# EAGLE design VCA3+ (EAGLE 7.2.0)
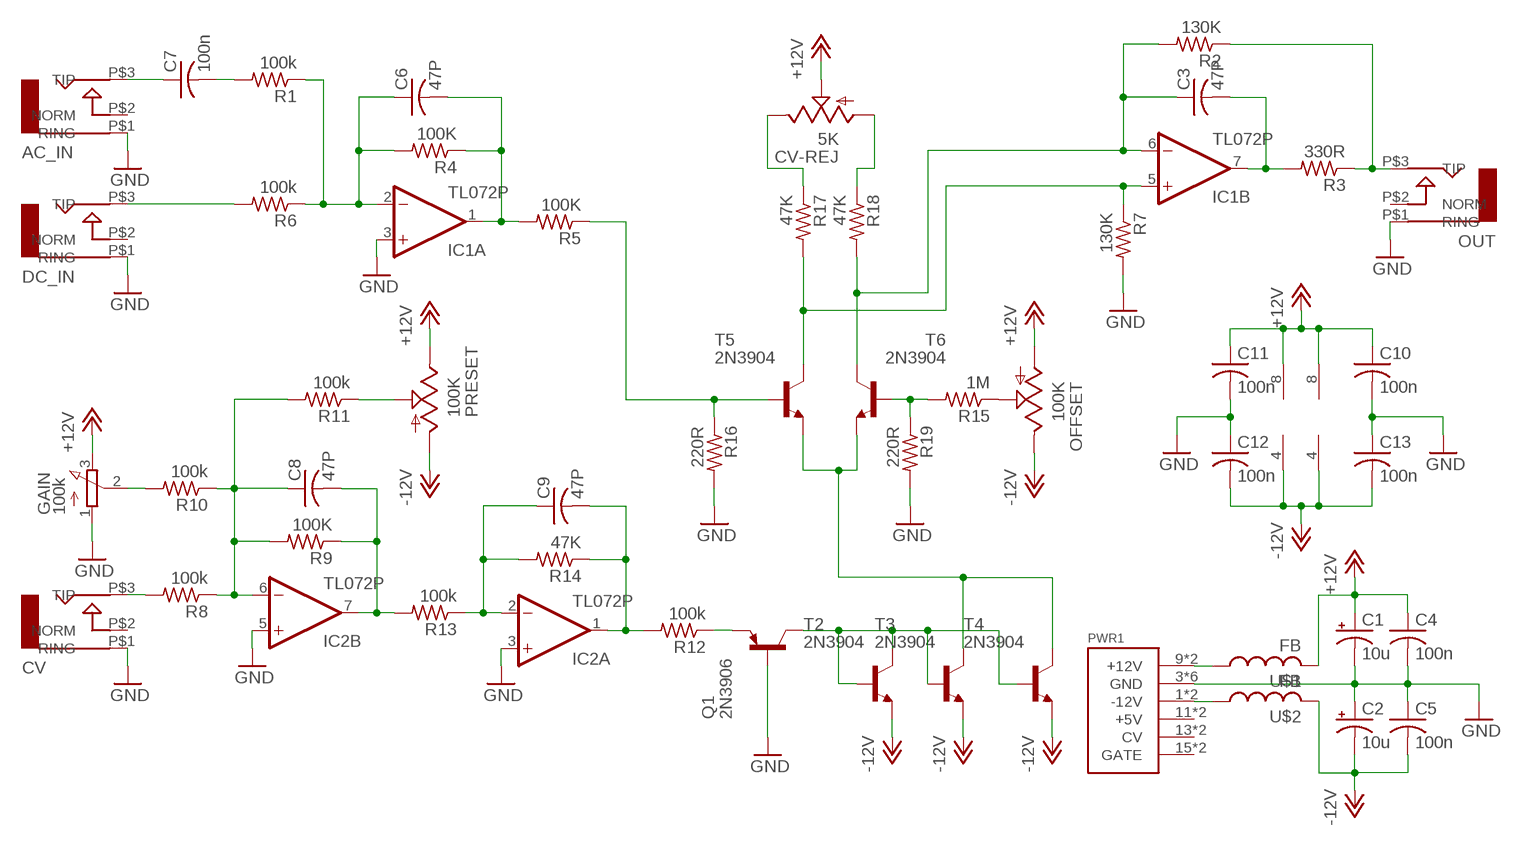
[diagram p0: schematic, sheet 1]

## Parts
AC_IN  AUDIO-JACK  [ERTHENVAR-JACK-90DEG]
C1  10u  CPOL-USB45181A  [B45181A]
C2  10u  CPOL-USB45181A  [B45181A]
C3  47P  C-US050-024X044  [C050-024X044]
C4  100n  C-US050-024X044  [C050-024X044]
C5  100n  C-US050-024X044  [C050-024X044]
C6  47P  C-US050-024X044  [C050-024X044]
C7  100n  C-US050-024X044  [C050-024X044]
C8  47P  C-US050-024X044  [C050-024X044]
C9  47P  C-US050-024X044  [C050-024X044]
C10  100n  C-US050-024X044  [C050-024X044]
C11  100n  C-US050-024X044  [C050-024X044]
C12  100n  C-US050-024X044  [C050-024X044]
C13  100n  C-US050-024X044  [C050-024X044]
CV  AUDIO-JACK  [ERTHENVAR-JACK-90DEG]
CV-REJ  5K  TRIM_US-B64Y  [B64Y]
DC_IN  AUDIO-JACK  [ERTHENVAR-JACK-90DEG]
GAIN  100k  3RP/1610N  [3RP/1610N]
IC1  TL072P  [DIL08]
IC2  TL072P  [DIL08]
OFFSET  100K  TRIM_US-B64Y  [B64Y]
OUT  AUDIO-JACK  [ERTHENVAR-JACK-90DEG]
PRESET  100K  TRIM_US-B64Y  [B64Y]
PWR1  POWER  [POWER_16]
Q1  2N3906  [TO92]
R1  100k  R-US_0207/10  [0207/10]
R2  130K  R-US_0207/10  [0207/10]
R3  330R  R-US_0207/10  [0207/10]
R4  100K  R-US_0207/10  [0207/10]
R5  100K  R-US_0207/10  [0207/10]
R6  100k  R-US_0207/10  [0207/10]
R7  130K  R-US_0207/10  [0207/10]
R8  100k  R-US_0207/10  [0207/10]
R9  100K  R-US_0207/10  [0207/10]
R10  100k  R-US_0207/10  [0207/10]
R11  100k  R-US_0207/10  [0207/10]
R12  100k  R-US_0207/10  [0207/10]
R13  100k  R-US_0207/10  [0207/10]
R14  47K  R-US_0207/10  [0207/10]
R15  1M  R-US_0207/10  [0207/10]
R16  220R  R-US_0207/10  [0207/10]
R17  47K  R-US_0207/10  [0207/10]
R18  47K  R-US_0207/10  [0207/10]
R19  220R  R-US_0207/10  [0207/10]
T2  2N3904  [TO92]
T3  2N3904  [TO92]
T4  2N3904  [TO92]
T5  2N3904  [TO92]
T6  2N3904  [TO92]
U$1  FB  [FB]
U$2  FB  [FB]

## Nets
+12V: C1.+ C4.1 C10.1 C11.1 CV-REJ.S GAIN.3(E) IC1.8(P:V+) IC2.8(P:V+) OFFSET.A PRESET.E U$1.P$2
-12V: C2.- C5.2 C12.2 C13.2 IC1.4(P:V-) IC2.4(P:V-) OFFSET.E PRESET.A T2.3(E) T3.3(E) T4.3(E) U$2.P$2
GND: AC_IN.P$1(RING) C1.- C2.+ C4.2 C5.1 C10.2 C11.2 C12.1 C13.1 CV.P$1(RING) DC_IN.P$1(RING) GAIN.1(A) IC1.3(A:+IN) IC2.3(A:+IN) IC2.5(B:+IN) OUT.P$1(RING) PWR1.3(GND) PWR1.4(GND) PWR1.5(GND) PWR1.6(GND) PWR1.7(GND) PWR1.8(GND) Q1.2(B) R7.2 R16.2 R19.2
N$1: PWR1.9(+12V) PWR1.10(+12V) U$1.P$1
N$2: PWR1.1(-12V) PWR1.2(-12V) U$2.P$1
N$3: AC_IN.P$3(TIP) C7.1
N$4: C7.2 R1.2
N$5: C3.2 IC1.7(B:OUT) R3.2
N$6: OUT.P$3(TIP) R2.1 R3.1
N$7: C6.1 IC1.2(A:-IN) R1.1 R4.2 R6.1
N$8: C6.2 IC1.1(A:OUT) R4.1 R5.2
N$9: IC1.5(B:+IN) R7.1 R17.2 T5.1(C)
N$10: CV.P$3(TIP) R8.2
N$11: C8.1 IC2.6(B:-IN) R8.1 R9.2 R10.1 R11.2
N$12: GAIN.2(S) R10.2
N$13: PRESET.S R11.1
N$14: DC_IN.P$3(TIP) R6.2
N$15: C8.2 IC2.7(B:OUT) R9.1 R13.2
N$16: Q1.3(E) R12.1
N$17: C9.1 IC2.2(A:-IN) R13.1 R14.2
N$18: C9.2 IC2.1(A:OUT) R12.2 R14.1
N$19: Q1.1(C) T2.1(C) T2.2(B) T3.2(B) T4.2(B)
N$20: T3.1(C) T4.1(C) T5.3(E) T6.3(E)
N$21: OFFSET.S R15.1
N$22: R5.1 R16.1 T5.2(B)
N$24: R15.2 R19.1 T6.2(B)
N$25: C3.1 IC1.6(B:-IN) R2.2 R18.2 T6.1(C)
N$26: CV-REJ.E R17.1
N$27: CV-REJ.A R18.1
Unconnected: AC_IN.P$2(NORM) CV.P$2(NORM) DC_IN.P$2(NORM) OUT.P$2(NORM) PWR1.11(+5V) PWR1.12(+5V) PWR1.13(CV) PWR1.14(CV) PWR1.15(GATE) PWR1.16(GATE)

## Library data of the parts
AC_IN CV DC_IN OUT = erthenvar:AUDIO-JACK: Switching Mono 3.5mm Audio Jack from Erthenvar.
C1 C2 = rcl:CPOL-US: POLARIZED CAPACITOR, American symbol
C3-C13 = rcl:C-US: CAPACITOR, American symbol
CV-REJ OFFSET PRESET = pot:TRIM_US-: POTENTIOMETER
GAIN = pot:3RP/1610N: 16mm Potentiometer one level Source: http://www.alphapotentiometers.net/html/16mm_pot_2.html
IC1 IC2 = linear:TL072: OP AMP
PWR1 = eurorack:POWER
Q1 = transistor-pnp:2N3906: PNP Transistor
R1-R19 = rcl:R-US_: RESISTOR, American symbol
T2-T6 = transistor:2N3904: NPN TRANSISTOR
U$1 U$2 = adafruit:FB: Ferrite bead Digikey #P9821BK-ND

## Board
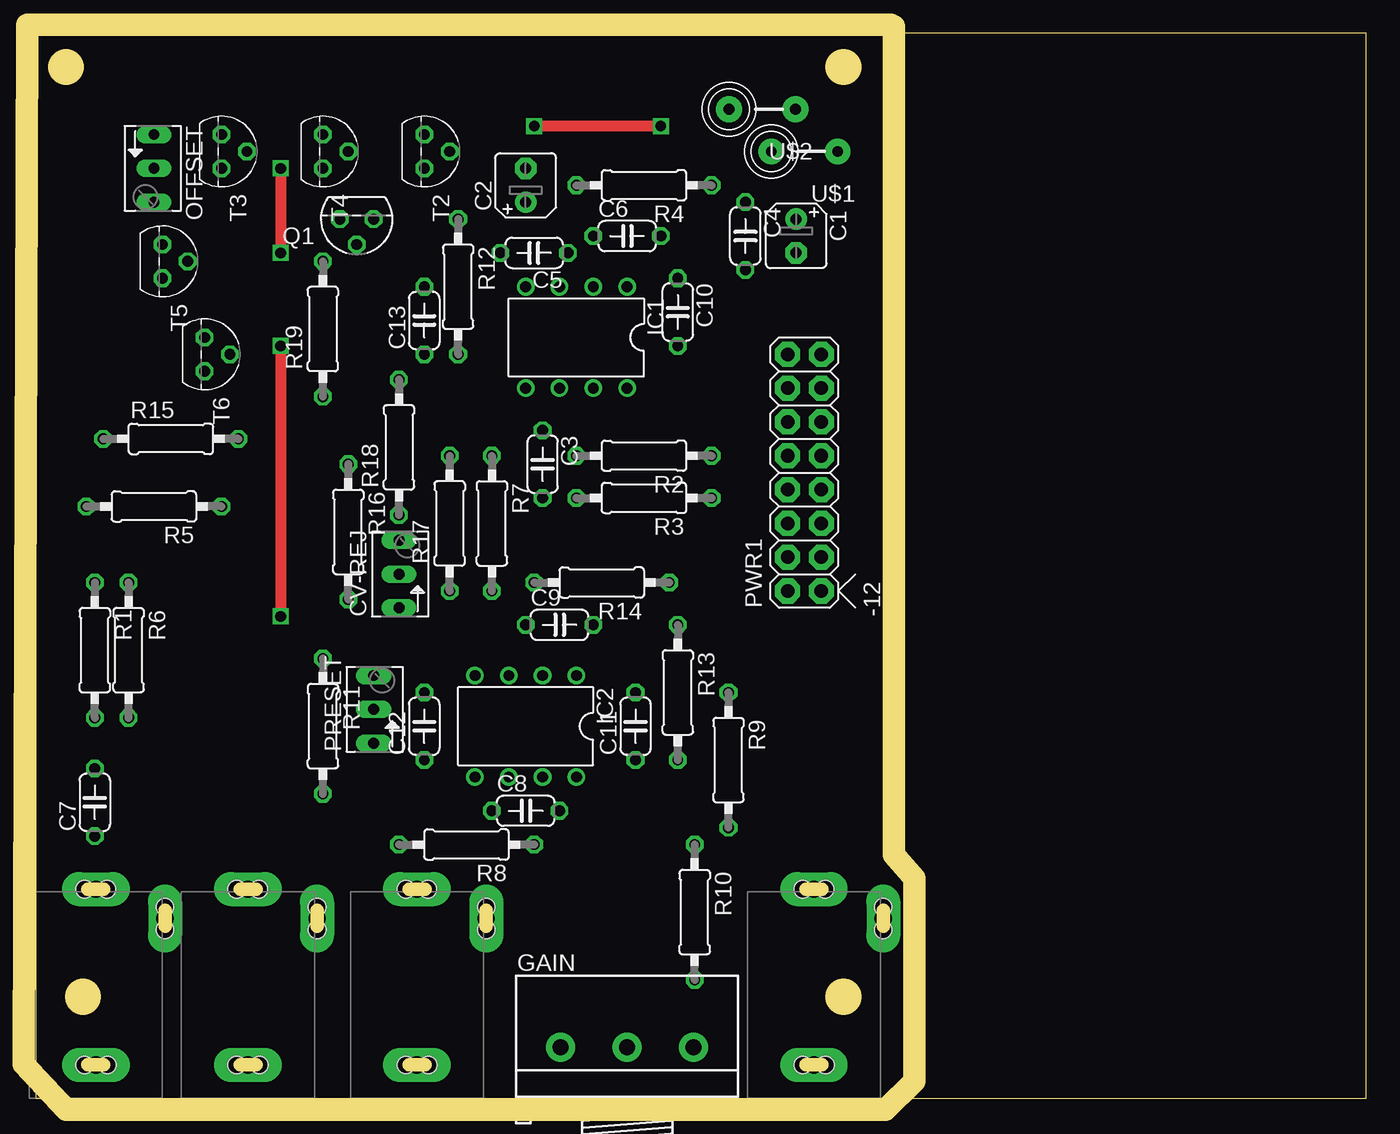
[diagram p1: board, top side]
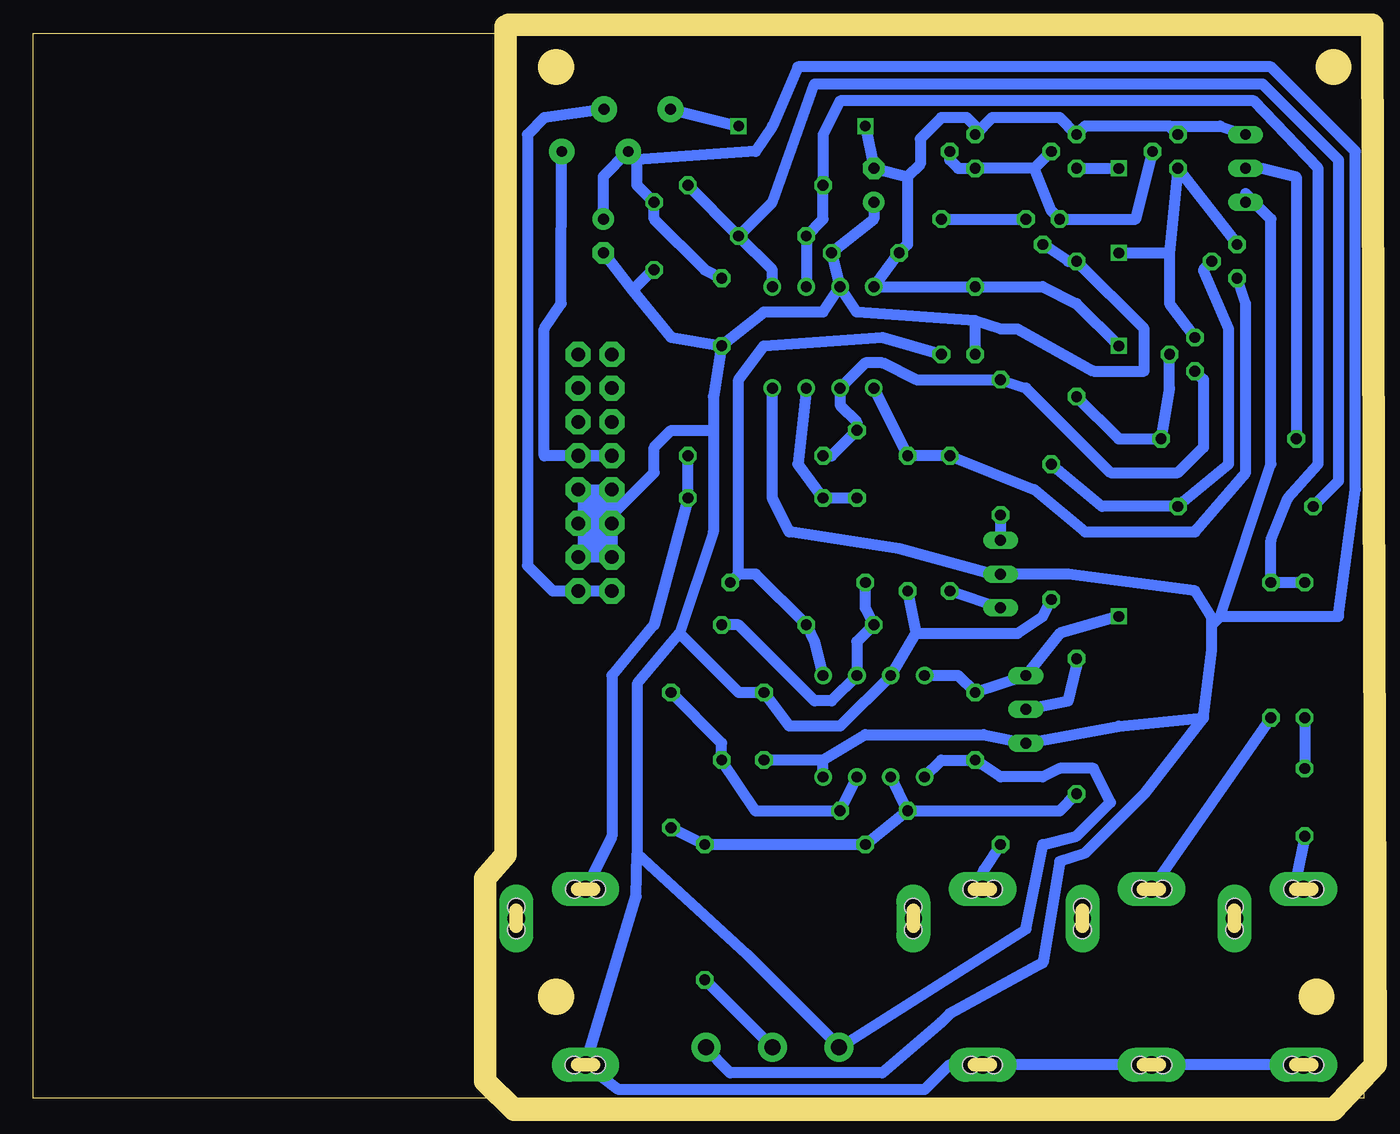
[diagram p2: board, bottom side, seen from below]

Size 100 x 80 mm. Coordinates in mm from the lower left corner, seen from the top.
Outline: 0,0 100,0 100,80 0,80 0,0
Copper layers (1*16): Top 0.035mm / dielectric 1.5mm / Bottom 0.035mm
Design rules "default *": minimum track width 32mil, minimum drill 31mil, track to track 16mil, track to pad 16mil, pad to pad 16mil, via to via 16mil, smd to smd 8mil, copper to edge 0mil, drill to drill 16mil, minimum pad ring 10mil, minimum via ring 8mil, stop-mask expansion 4mil, vias tented up to drill 0mil, thermal gap 10mil
Milling: area 1.8,77 to 2.8,78; area 60.2,77 to 61.2,78; area 60.2,7.1 to 61.2,8.1; area 3,7.1 to 4.1,8.1; 8 lines

### Footprints (pad centres in the part's own frame; a part is rotated, then mirrored left to right if it is on the bottom)
ERTHENVAR-JACK-90DEG = drill 1.3 pad 2.54 long: P$1 5,-2.5; P$2 -0.2,-13.5; P$3 5,-15.7 | hole 1.3: 5.842,-2.489; 4.14,-2.489; -0.203,-12.649; -0.203,-14.351; 5.842,-15.697; 4.166,-15.697
B45181A = drill 0.813 pad 1.6: + -1.27,0 | drill 0.813 pad 1.6 octagon: - 1.27,0
C050-024X044 = drill 0.813 octagon: 1 -2.54,0; 2 2.54,0
B64Y = drill 0.813 long: A 2.54,0; E -2.54,0; S 0,0
3RP/1610N = drill 1.2 pad 2.184: 1 -5,0; 2 0,0; 3 5,0
DIL08 = drill 0.813 pad 1.27: 1 -3.81,-3.81; 2 -1.27,-3.81; 3 1.27,-3.81; 4 3.81,-3.81; 5 3.81,3.81; 6 1.27,3.81; 7 -1.27,3.81; 8 -3.81,3.81
POWER_16 = drill 1.016 pad 1.88 octagon: 1 -6.35,-1.27; 2 -6.35,1.27; 3 -3.81,-1.27; 4 -3.81,1.27; 5 -1.27,-1.27; 6 -1.27,1.27; 7 1.27,-1.27; 8 1.27,1.27; 9 3.81,-1.27; 10 3.81,1.27; 11 6.35,-1.27; 12 6.35,1.27; 13 8.89,-1.27; 14 8.89,1.27; 15 11.43,-1.27; 16 11.43,1.27
TO92 = drill 0.813 octagon: 1 1.27,0; 2 0,1.905; 3 -1.27,0
0207/10 = drill 0.813 octagon: 1 -5.08,0; 2 5.08,0
FB = drill 0.8 pad 1.93: P$1 -2.5,0; P$2 2.5,0

### Placement (x,y rotation side)
AC_IN  9.53,0 180 top
C1  57.15,64.77 270 top
C2  36.83,68.58 90 top
C3  38.1,47.62 270 top
C4  53.34,64.77 270 top
C5  37.47,63.5 180 top
C6  44.45,64.77 0 top
C7  4.45,22.23 90 top
C8  36.83,21.59 0 top
C9  39.37,35.56 0 top
C10  48.26,59.05 270 top
C11  45.09,27.94 90 top
C12  29.21,27.94 90 top
C13  29.21,58.42 90 top
CV  33.66,0 180 top
CV-REJ  27.3,39.37 90 top
DC_IN  20.95,0 180 top
GAIN  44.45,3.81 0 top
IC1  40.64,57.15 180 top
IC2  36.83,27.94 180 top
OFFSET  8.89,69.85 270 top
OUT  63.5,0 180 top
PRESET  25.4,29.21 90 top
PWR1  57.78,44.45 90 top
Q1  24.13,66.04 180 top
R1  4.45,33.66 270 top
R2  45.72,48.26 180 top
R3  45.72,45.09 180 top
R4  45.72,68.58 180 top
R5  8.89,44.45 180 top
R6  6.99,33.66 270 top
R7  34.29,43.18 270 top
R8  32.38,19.05 180 top
R9  52.07,25.4 270 top
R10  49.53,13.97 270 top
R11  21.59,27.94 270 top
R12  31.75,60.96 270 top
R13  48.26,30.48 270 top
R14  42.55,38.73 180 top
R15  10.16,49.53 0 top
R16  23.5,42.55 270 top
R17  31.11,43.18 90 top
R18  27.3,48.9 90 top
R19  21.59,57.78 90 top
T2  29.21,71.12 270 top
T3  13.97,71.12 270 top
T4  21.59,71.12 270 top
T5  9.53,62.87 270 top
T6  12.7,55.88 270 top
U$1  57.78,71.12 180 top
U$2  54.61,74.3 180 top

### Tracks (layer width: path | path; a pad name or v marks a point on that pad's centre or on a via)
+12V
  Bottom 0.813: C10.1 49.53,62.23 53.34,66.04 C4.1 54.65,68.62 54.65,70.48 | 55.24,71.12 U$1.P$2 | IC2.8 40.64,25.4 | 40.64,25.4 37.47,27.3 28.57,27.3 PRESET.E 18.41,27.94 12.06,28.57 | 12.06,28.57 11.43,33.66 11.43,35.56 | 40.64,25.4 C11.1 | IC1.8 44.45,45.09 43.18,42.55 34.92,41.27 27.94,39.37 CV-REJ.S 22.23,39.37 12.7,38.1 11.48,36.13 11.43,36.08 11.43,35.56 | OFFSET.A 8.89,67.94 6.99,66.04 6.99,47.62 10.79,36.2 | GAIN.3 49.53,3.81 47.62,1.91 36.2,1.91 31.75,5.71 31.11,6.35 24.13,10.16 22.86,17.78 20.95,18.41 16.51,22.86 12.06,28.57 | 54.65,70.48 45.72,71.12 44.45,73.03 42.55,77.47 6.99,77.47 0.64,71.12 0.64,45.72 1.91,36.2 10.79,36.2 | 10.79,36.2 11.43,35.56 | 54.65,70.48 U$1.P$2 | C1.+ 57.15,69.25 U$1.P$2
-12V  (via drill 0.8)
  Top 0.813: v46.99,73.03 v37.47,73.03 | v18.41,56.52 v18.41,36.2
  Bottom 0.813: OFFSET.E 10.79,73.03 14.61,73.03 | T3.3 14.61,73.03 | 34.29,69.22 34.29,64.14 C5.2 IC1.4 C13.2 24.13,60.96 21.59,59.69 v18.41,56.52 | IC2.4 30.48,31.75 C12.2 PRESET.A 22.86,34.92 v18.41,36.2 | 14.61,73.03 20.95,73.03 T4.3 22.86,73.66 27.94,73.66 T2.3 29.21,73.03 29.84,73.66 31.75,73.66 33.34,72.07 33.34,70.17 34.29,69.22 | 34.29,69.22 C2.- v37.47,73.03 | U$2.P$2 v46.99,73.03
GND
  Bottom 0.813: IC2.5 31.75,25.4 C12.1 27.3,24.13 24.13,24.13 22.86,24.77 20.32,24.77 19.05,22.23 21.59,19.68 24.13,19.05 25.4,12.7 39.37,3.81 | R16.2 24.13,36.2 26.04,34.92 33.66,34.92 | R7.2 33.66,34.92 | 33.66,34.92 IC2.3 39.37,27.94 43.18,27.94 C11.2 46.99,30.48 51.44,34.92 | IC1.3 38.1,59.05 29.21,58.42 | 29.21,58.42 27.3,57.78 26.04,57.78 20.32,54.61 16.51,54.61 16.51,57.78 R19.2 22.23,62.87 Q1.2 | PWR1.7 PWR1.8 PWR1.6 | PWR1.6 PWR1.4 | PWR1.4 PWR1.3 | PWR1.6 PWR1.5 | C1.- 54.96,60.69 | 54.96,60.69 52.07,57.15 C10.2 | IC1.3 40.64,59.05 45.09,59.05 C10.2 | 51.44,34.92 48.9,42.55 48.9,50.16 | 48.9,50.16 48.9,52.7 C10.2 | 39.37,3.81 46.35,10.79 54.61,18.41 | 54.61,18.41 54.61,31.11 51.44,34.92 | 39.37,3.81 GAIN.1 | 54.61,18.41 54.69,15.16 OUT.P$1 56,0.64 33.02,0.64 31.16,2.5 CV.P$1 DC_IN.P$1 AC_IN.P$1 | C2.+ 36.83,66.04 C5.1 IC1.3 | C4.2 53.42,62.23 54.96,60.69 | PWR1.4 57.15,43.18 53.34,46.99 53.34,48.9 52.07,50.16 48.9,50.16 | C13.1 29.21,58.42
N$1
  Bottom 0.813: PWR1.9 PWR1.10 61.59,48.26 61.59,57.78 60.33,59.69 U$1.P$1
N$2
  Bottom 0.813: PWR1.2 PWR1.1 60.96,38.1 62.87,40.01 62.87,72.39 61.59,73.66 U$2.P$1
N$3
  Bottom 0.813: C7.1 5.08,16.51 6.35,15.62 AC_IN.P$3
N$4
  Bottom 0.813: R1.2 C7.2
N$5
  Bottom 0.813: IC1.7 42.55,47.62 R3.2 C3.2
N$6  (1 unrouted)
  Bottom 0.813: R2.1 R3.1 53.34,35.56 56.52,31.75 56.52,19.68 58.42,15.88
N$7
  Bottom 0.813: R1.1 R6.1 6.99,41.91 5.71,45.09 3.43,47.62 3.43,69.85 8.26,74.93 39.37,74.93 40.64,72.39 R4.2 40.64,66.04 C6.1 IC1.2
N$8
  Bottom 0.813: R5.2 1.91,46.35 1.91,70.48 7.62,76.2 41.27,76.2 44.45,67.31 C6.2 | C6.2 R4.1 | IC1.1 44.45,62.23 C6.2
N$9
  Bottom 0.813: T5.1 8.89,59.69 8.89,46.99 12.7,42.55 20.95,42.55 24.77,45.72 R17.2 R7.1 IC1.5
N$10
  Bottom 0.813: R8.2 28.57,17.14 29.21,15.88 28.83,15.88 CV.P$3
N$11
  Bottom 0.813: R9.2 R10.1 R8.1 C8.1 | R11.2 22.86,21.59 C8.1 | C8.1 IC2.6
N$12
  Bottom 0.813: GAIN.2 R10.2
N$13
  Bottom 0.813: R11.1 21.59,32.38 22.23,29.84 PRESET.S
N$14
  Bottom 0.813: R6.2 15.88,15.88 17.68,15.88 DC_IN.P$3
N$15
  Bottom 0.813: IC2.7 C8.2 45.72,21.59 R13.2 48.26,26.67 R9.1
N$16
  Bottom 0.813: R12.1 Q1.3
N$17
  Bottom 0.813: R14.2 37.47,36.83 C9.1 38.1,34.29 IC2.2 40.01,29.84 41.27,29.84 46.99,35.56 R13.1
N$18
  Bottom 0.813: IC2.1 41.27,34.29 C9.2 45.72,39.37 46.99,39.37 | 46.99,39.37 R14.1 | R12.2 36.2,57.15 45.09,56.52 46.99,53.98 46.99,39.37
N$19
  Bottom 0.813: T3.2 17.14,66.04 Q1.1 23.5,66.67 24.77,69.85 | 24.77,69.85 T4.2 | T2.2 31.11,70.48 30.48,69.85 T2.1 24.77,69.85
N$20  (via drill 0.8)
  Top 0.813: v18.41,69.85 v18.41,63.5
  Bottom 0.813: T6.3 14.61,59.69 14.61,63.5 | 14.61,63.5 T3.1 T5.3 | T4.1 v18.41,69.85 | v18.41,63.5 14.61,63.5
N$21
  Bottom 0.813: R15.1 5.08,69.22 7.62,69.85 OFFSET.S
N$22
  Bottom 0.813: R16.1 19.68,44.45 R5.1 10.16,47.62 10.16,57.78 12.06,62.23 T5.2
N$24
  Bottom 0.813: R19.1 18.41,49.53 R15.2 14.61,53.34 T6.2
N$25
  Bottom 0.813: T6.1 12.06,53.98 12.06,48.9 13.97,46.99 19.05,46.99 25.4,53.34 R18.2 33.66,53.98 36.2,55.24 37.47,55.24 IC1.6 39.37,52.07 38.1,50.8 C3.1 40.01,48.26 R2.2
N$26
  Bottom 0.813: R17.1 CV-REJ.E
N$27
  Bottom 0.813: R18.1 CV-REJ.A
(copper drawn outside any net)
  shapes: Bottom area x1